# Altium schematic sheet Pipa PRM.SchDoc
size 1188 x 840 mm; SheetNumber: 1; SheetTotal: 1
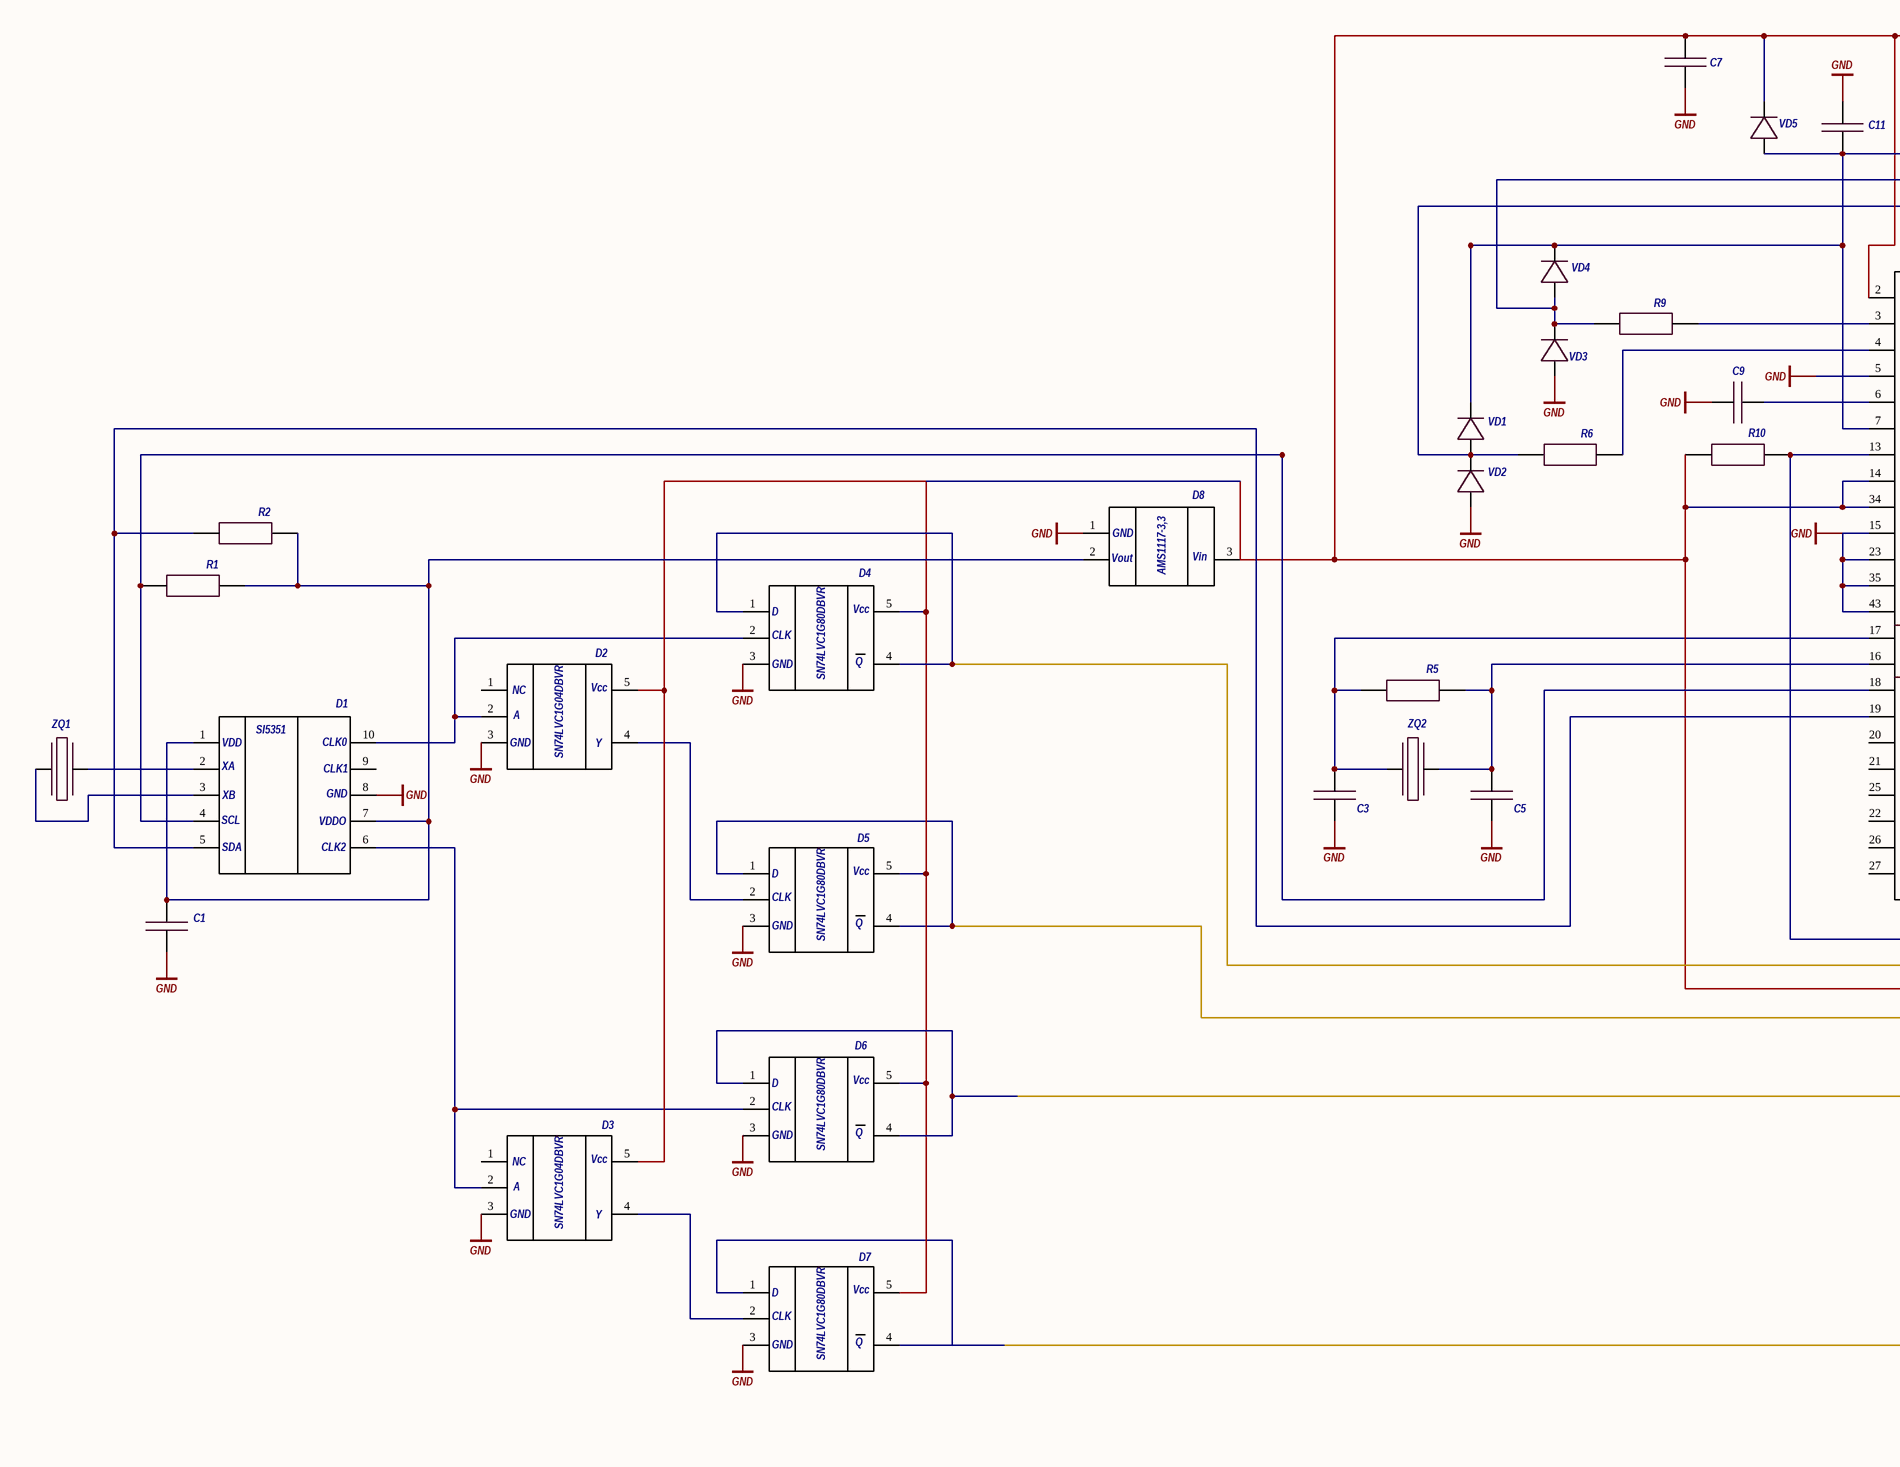
[diagram p0: Pipa PRM.SchDoc, top left]
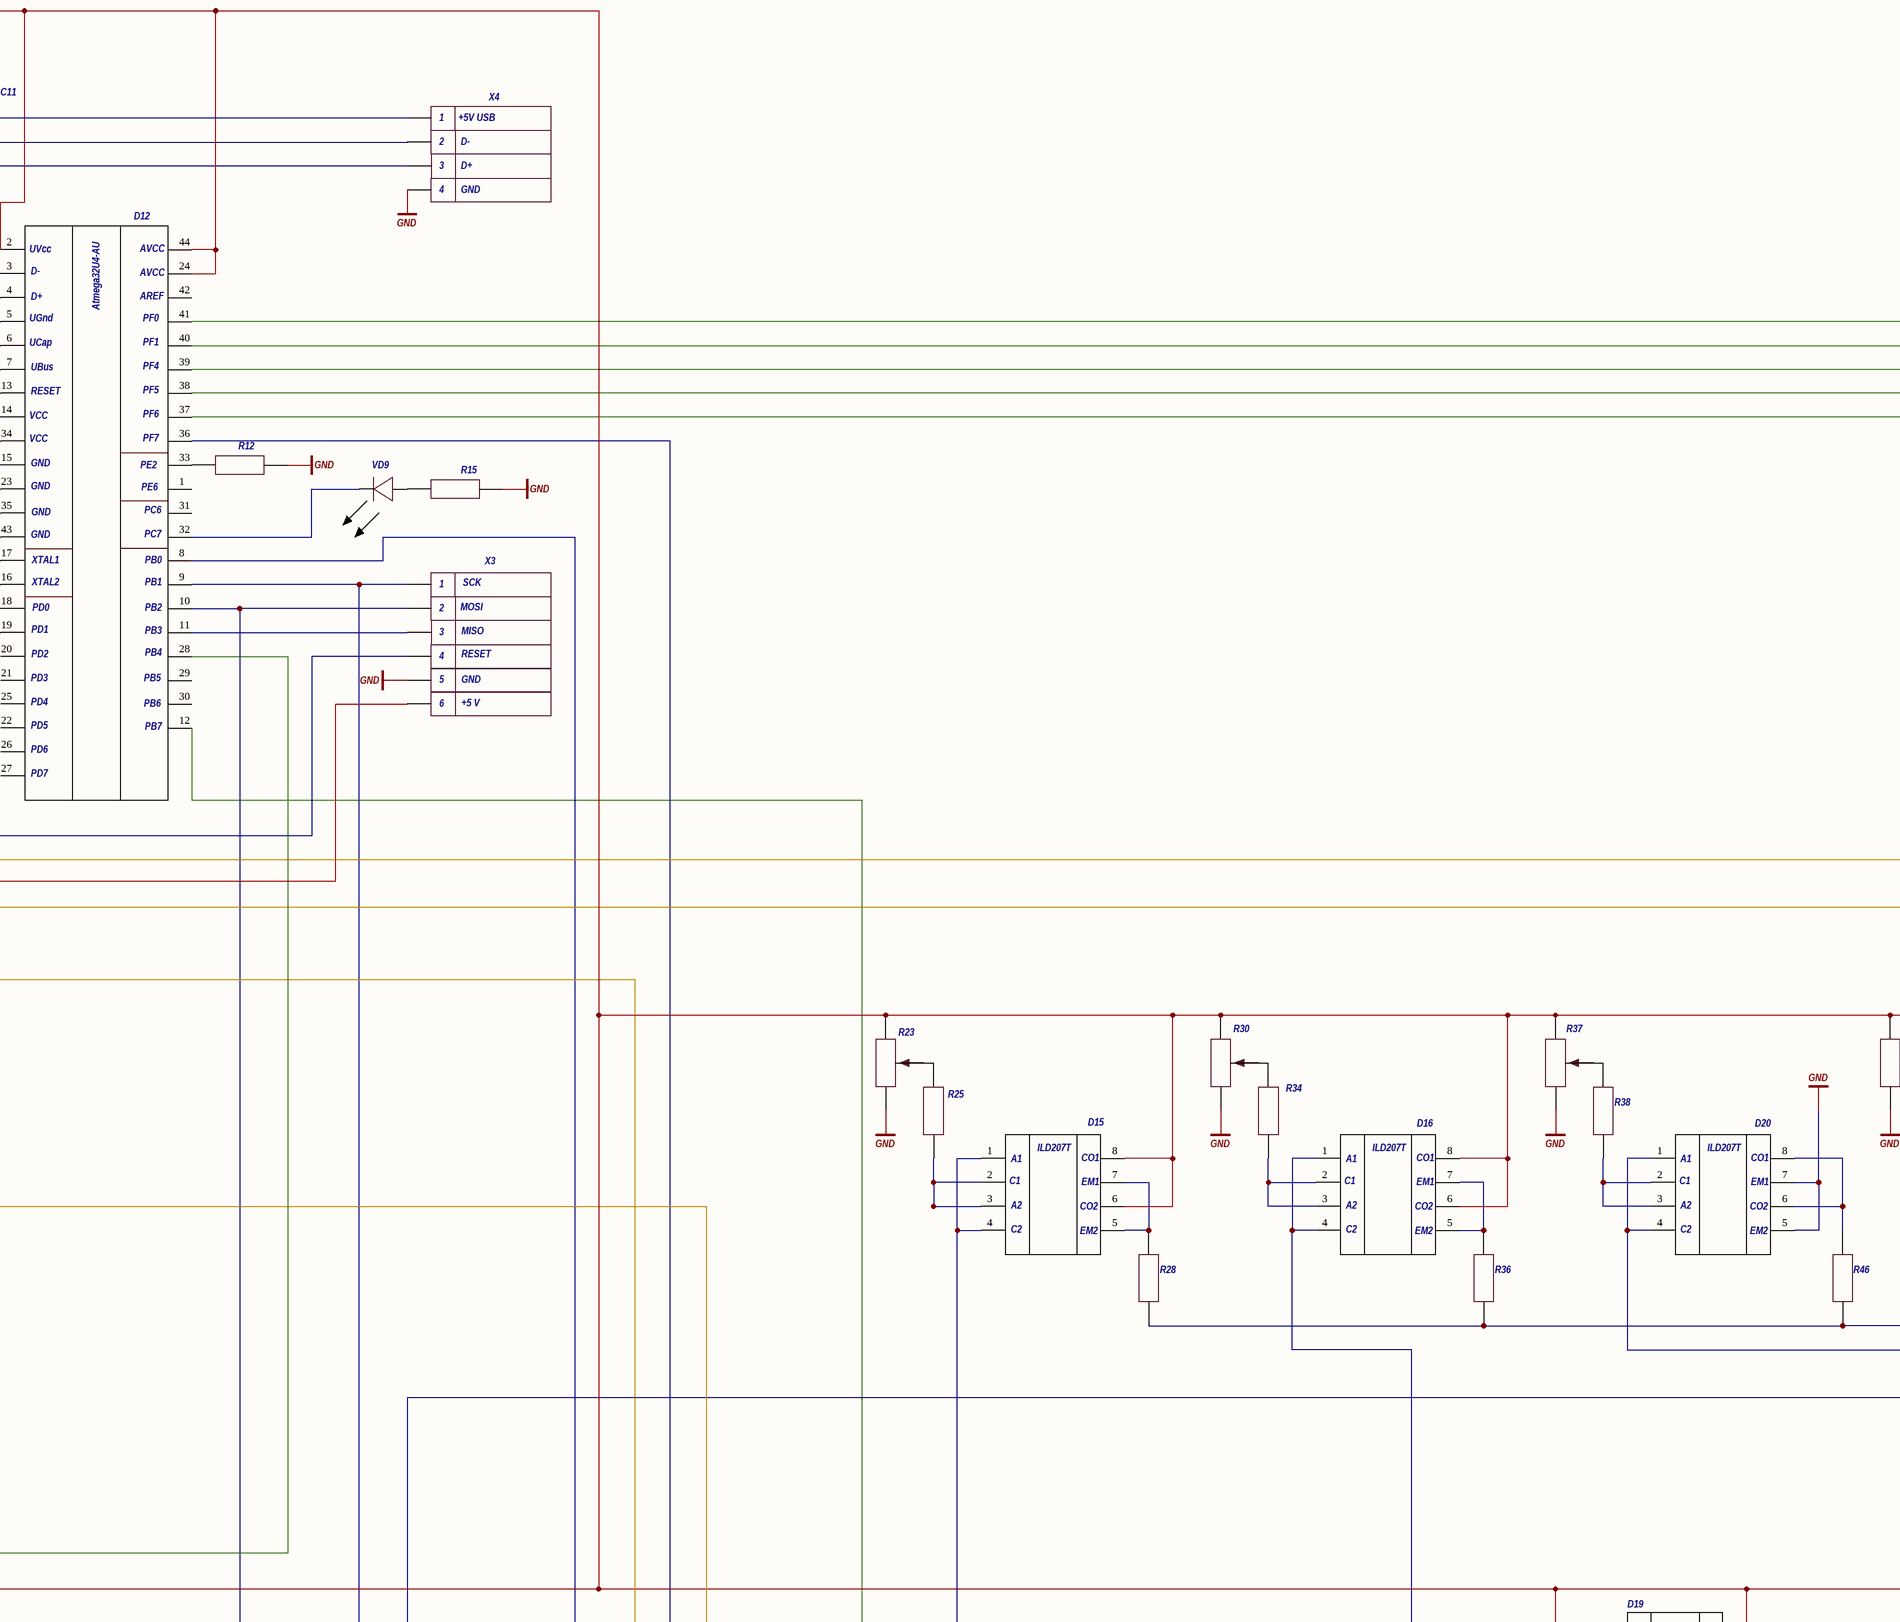
[diagram p1: Pipa PRM.SchDoc, top middle]
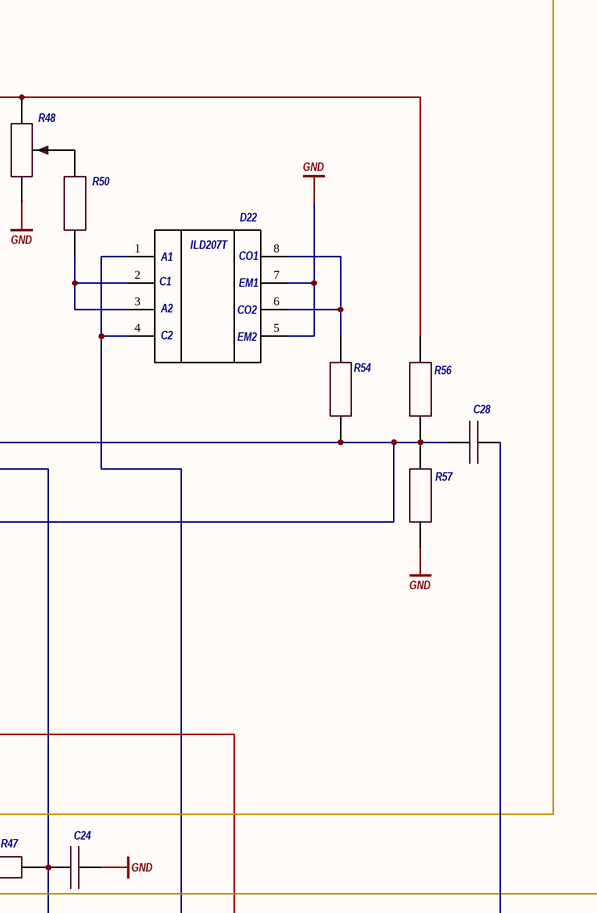
[diagram p2: Pipa PRM.SchDoc, top right]
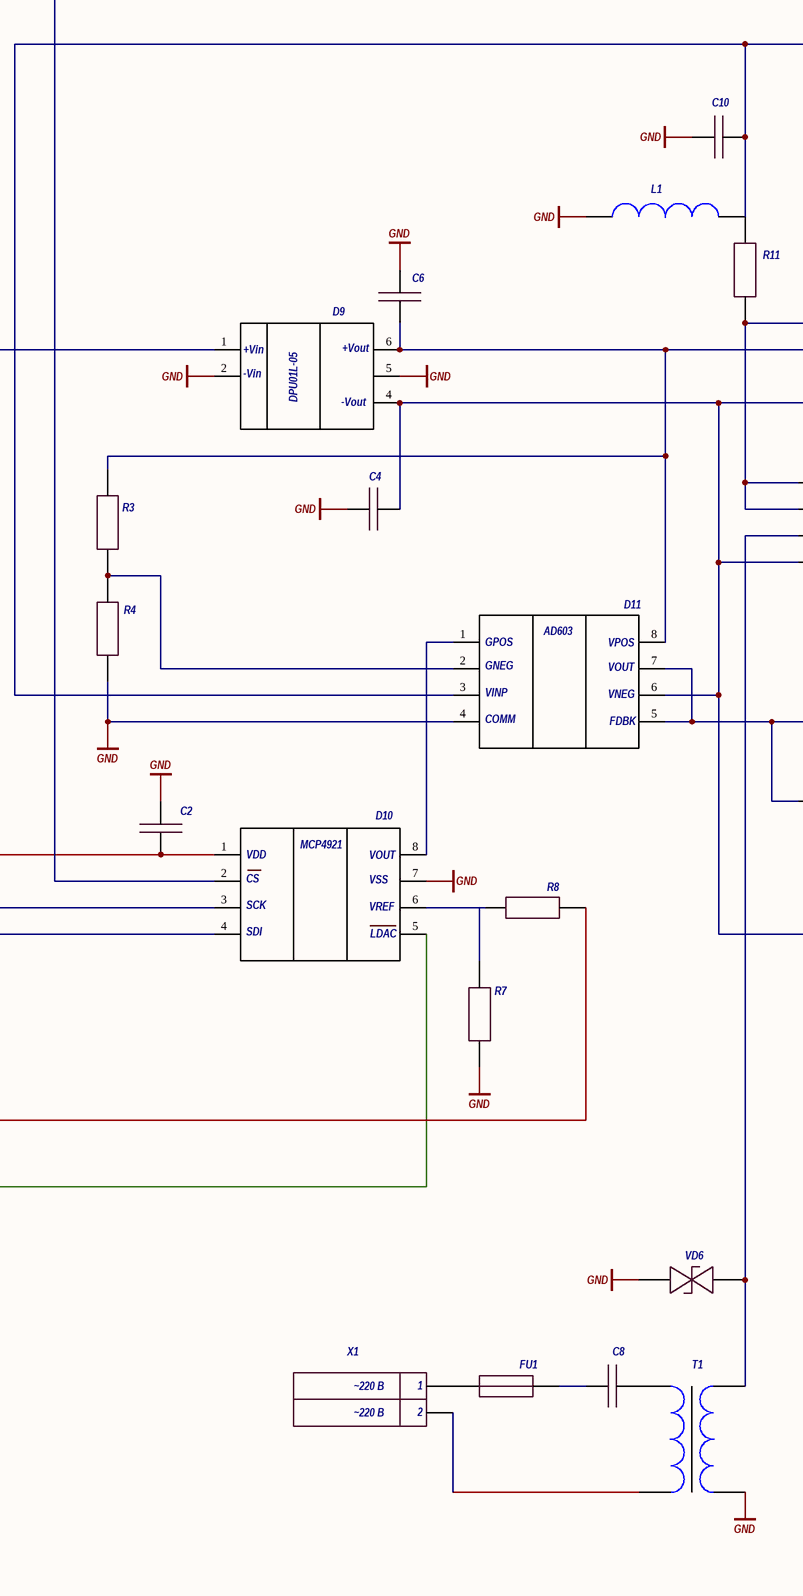
[diagram p3: Pipa PRM.SchDoc, bottom left]
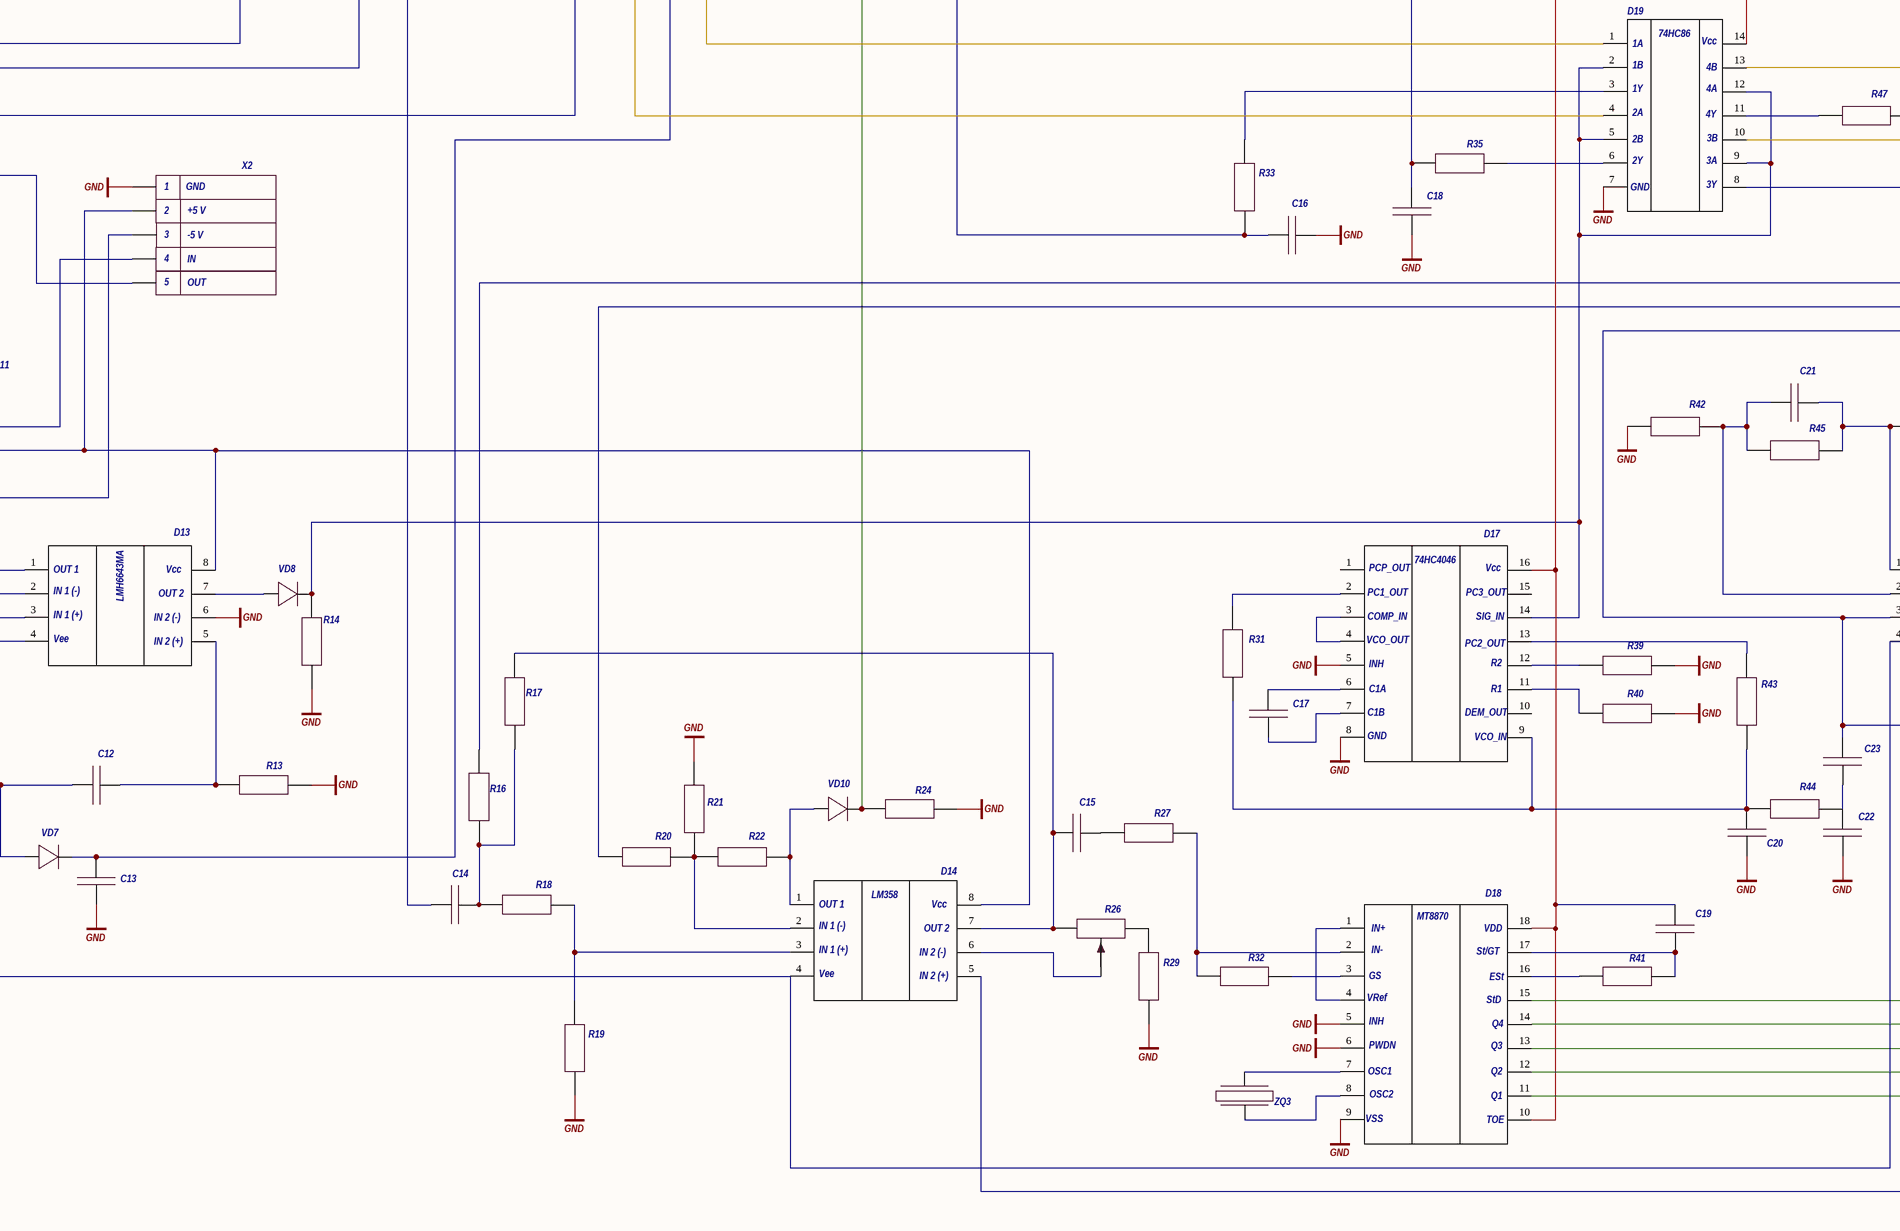
[diagram p4: Pipa PRM.SchDoc, bottom middle]
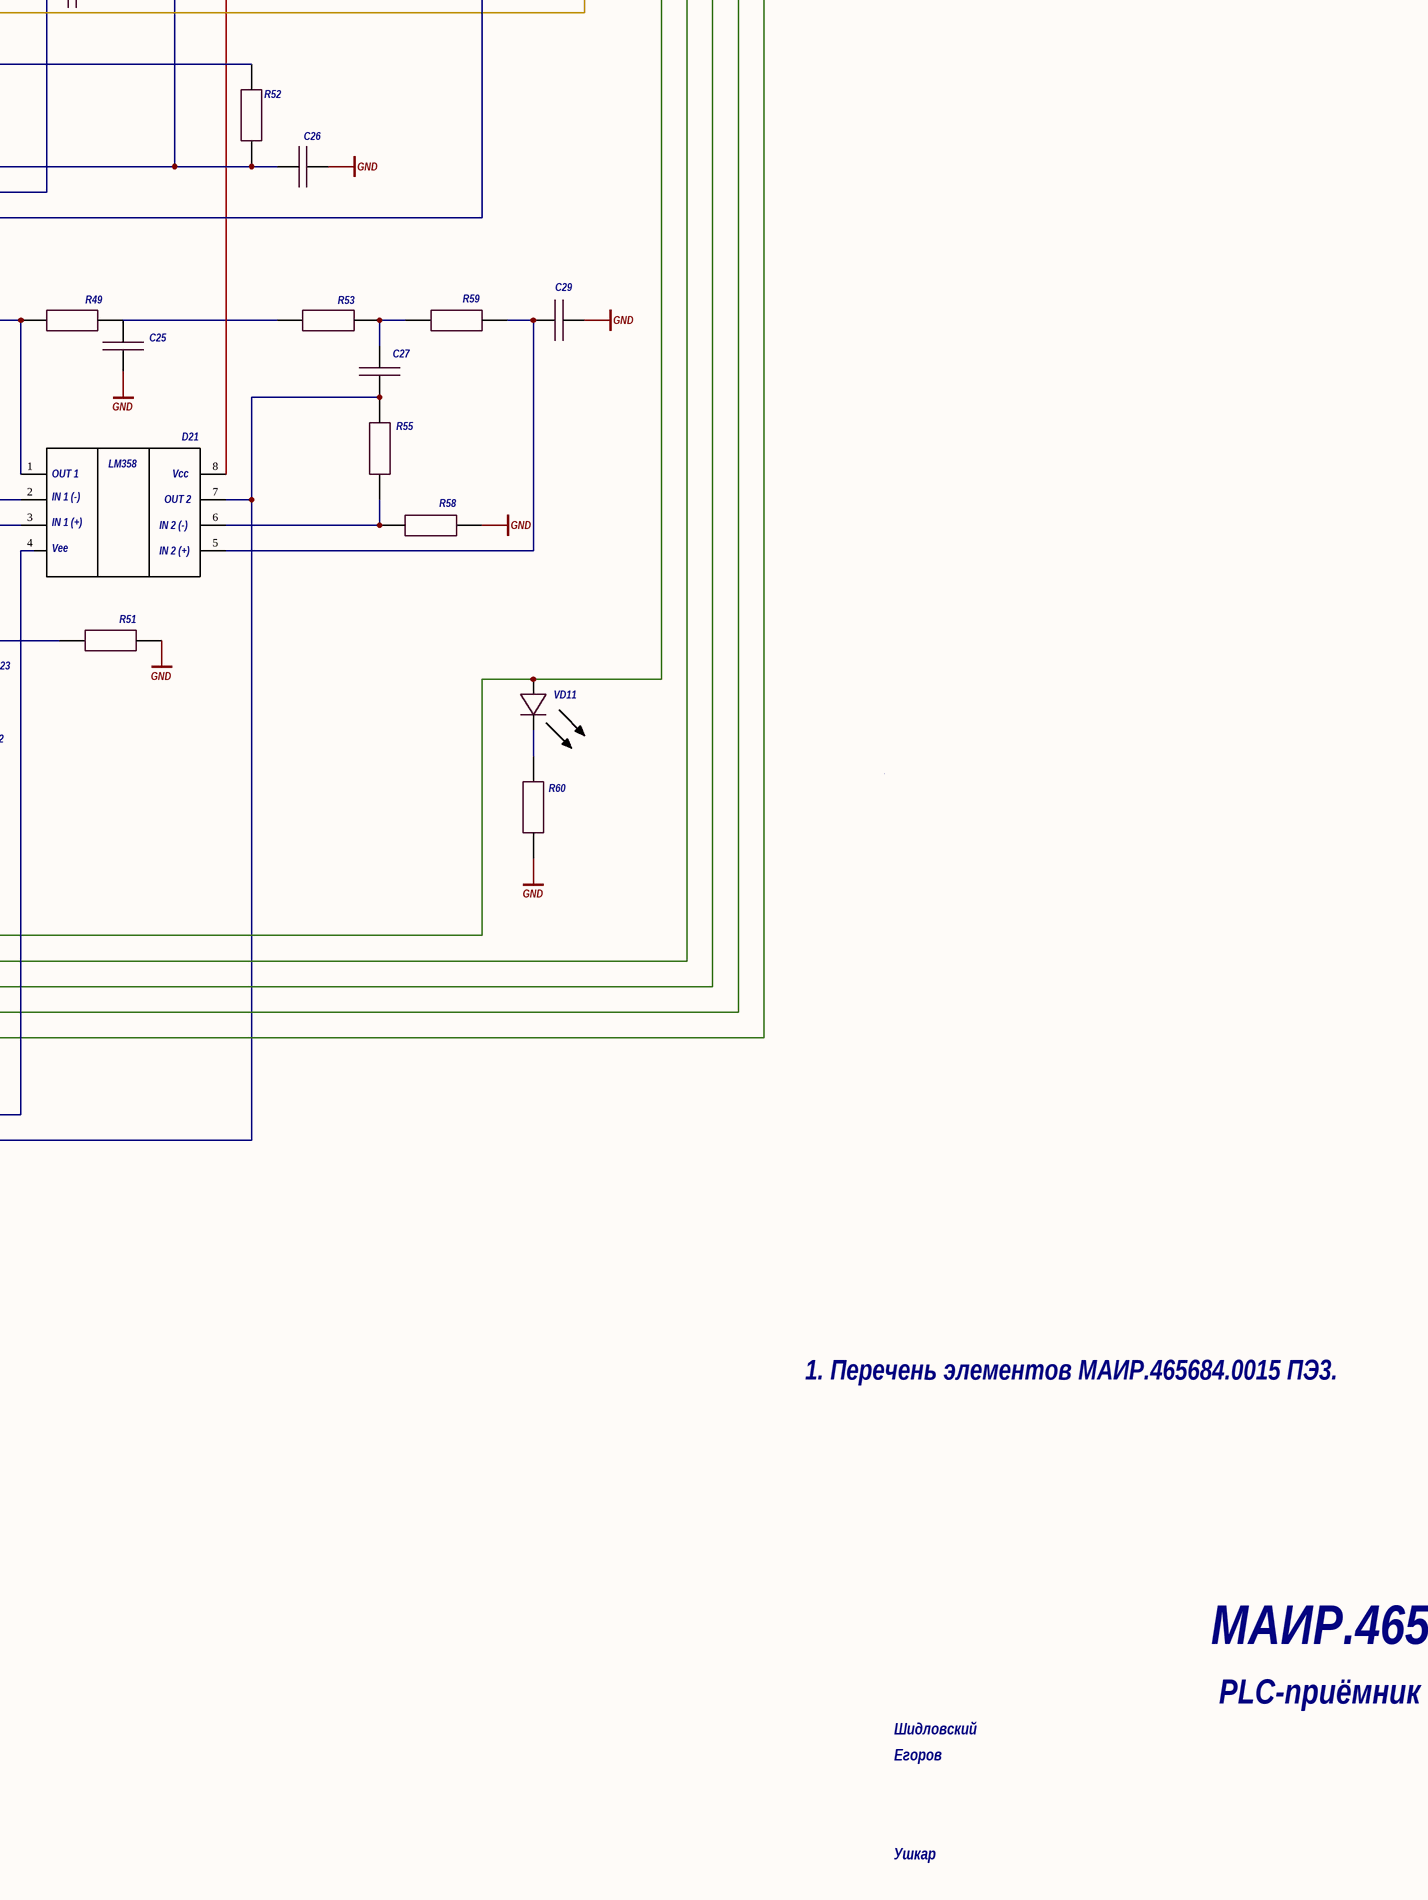
[diagram p5: Pipa PRM.SchDoc, bottom right]

## Parts
C1  22 мкФ  [С_0805]  (value not drawn)
C2  4,7 мкФ  (value not drawn)
C3  24 пФ  (value not drawn)
C4  22 мкФ  (value not drawn)
C5  24 пФ  (value not drawn)
C6  22 мкФ  (value not drawn)
C7  470 мкФ 6,3 В Электролит.  (value not drawn)
C8  Конденсатор  [С_0805]  (value not drawn)
C9  1 мкФ  (value not drawn)
C10  Конденсатор  (value not drawn)
C11  10 мкФ  (value not drawn)
C12  10 мкФ  (value not drawn)
C13  1 мкФ  (value not drawn)
C14  22 мкФ  (value not drawn)
C15  1 мкФ  [С_0805]  (value not drawn)
C16  100 мкФ (1206)  (value not drawn)
C17  Конденсатор  [С_0805]  (value not drawn)
C18  100 мкФ (1206)  (value not drawn)
C19  0,01 мкФ  [С_0805]  (value not drawn)
C20  Конденсатор  [C_1206]  (value not drawn)
C21  Конденсатор  [С_0805]  (value not drawn)
C22  Конденсатор  [С_0805]  (value not drawn)
C23  22 мкФ  (value not drawn)
C24  100 мкФ (1206)  (value not drawn)
C25  4,3 нФ  (value not drawn)
C26  100 мкФ (1206)  (value not drawn)
C27  11 нФ  (value not drawn)
C28  22 мкФ  (value not drawn)
C29  620 пФ  (value not drawn)
D1  Микросхема SI5351  [MSOP-10]  (value not drawn)
D2  Микросхема SN74LVC1G04DBVR  (value not drawn)
D3  Микросхема SN74LVC1G04DBVR  (value not drawn)
D4  Микросхема SN74LVC1G80DBVR  (value not drawn)
D5  Микросхема SN74LVC1G80DBVR  (value not drawn)
D6  Микросхема SN74LVC1G80DBVR  (value not drawn)
D7  Микросхема SN74LVC1G80DBVR  (value not drawn)
D8  Микросхема AMS1117-3,3  [SOT-223]  (value not drawn)
D9  Микросхема DPU01L-05  (value not drawn)
D10  Микросхема MCP4921  (value not drawn)
D11  Микросхема AD603  (value not drawn)
D12  Микросхема ATmega32U4-AU  (value not drawn)
D13  Микросхема LMH6643MA  (value not drawn)
D14  D  [SOP-8]  (value not drawn)
D15  Микросхема ILD207T  (value not drawn)
D16  Микросхема ILD207T  (value not drawn)
D17  D  [SO16]  (value not drawn)
D18  D  [DIP18]  (value not drawn)
D19  Микросхема 74HC86  (value not drawn)
D20  Микросхема ILD207T  (value not drawn)
D21  D  [SOP-8]  (value not drawn)
D22  Микросхема ILD207T  (value not drawn)
FU1  H520PT  [FU_522.1100]  (value not drawn)
L1  Катушка индуктивности  (value not drawn)
R1  10 кОм  [R_0805]  (value not drawn)
R2  10 кОм  [R_0805]  (value not drawn)
R3  18 кОм  (value not drawn)
R4  2 кОм  (value not drawn)
R5  1 МОм  (value not drawn)
R6  22 Ом  (value not drawn)
R7  1,2 кОм  (value not drawn)
R8  4,7 кОм  (value not drawn)
R9  22 Ом  (value not drawn)
R10  10 кОм  (value not drawn)
R11  Резистор  (value not drawn)
R12  10 кОм  (value not drawn)
R13  100 кОм  (value not drawn)
R14  10 кОм  (value not drawn)
R15  1 кОм  (value not drawn)
R16  1 МОм  (value not drawn)
R17  1 МОм  (value not drawn)
R18  0 Ом  (value not drawn)
R19  1 МОм  (value not drawn)
R20  1 МОм  (value not drawn)
R21  0 Ом  (value not drawn)
R22  1 МОм  (value not drawn)
R23  100 Ом 3362P-1-101LF  (value not drawn)
R24  10 кОм  (value not drawn)
R25  1 кОм  (value not drawn)
R26  10 кОм 3362P-1-103LF  (value not drawn)
R27  100 кОм  [R_0805]  (value not drawn)
R28  10 кОм  (value not drawn)
R29  1 кОМ  [R_0805]  (value not drawn)
R30  100 Ом 3362P-1-101LF  (value not drawn)
R31  Резистор  [R_0805]  (value not drawn)
R32  100 кОм  [R_0805]  (value not drawn)
R33  100 Ом  (value not drawn)
R34  1 кОм  (value not drawn)
R35  100 Ом  (value not drawn)
R36  10 кОм  (value not drawn)
R37  100 Ом 3362P-1-101LF  (value not drawn)
R38  1 кОм  (value not drawn)
R39  Резистор  [R_0805]  (value not drawn)
R40  Резистор  [R_0805]  (value not drawn)
R41  10 кОм  [R_0805]  (value not drawn)
R42  Резистор  [R_0805]  (value not drawn)
R43  Резистор  [R_0805]  (value not drawn)
R44  Резистор  [R_0805]  (value not drawn)
R45  Резистор  [R_0805]  (value not drawn)
R46  10 кОм  (value not drawn)
R47  100 Ом  (value not drawn)
R48  100 Ом 3362P-1-101LF  (value not drawn)
R49  10 кОм  (value not drawn)
R50  1 кОм  (value not drawn)
R51  100 кОм  (value not drawn)
R52  100 Ом  (value not drawn)
R53  10 кОм  (value not drawn)
R54  10кОм  (value not drawn)
R55  0 Ом  (value not drawn)
R56  10 кОм  (value not drawn)
R57  10 кОм  (value not drawn)
R58  1 МОм  (value not drawn)
R59  10 кОм  (value not drawn)
R60  1 кОм  [R_0805]  (value not drawn)
T1  PLA10AS3021  [T_PLA10]  (value not drawn)
VD1  BAT60AE (SOD-323)  (value not drawn)
VD2  BAT60AE (SOD-323)  (value not drawn)
VD3  BAT60AE (SOD-323)  (value not drawn)
VD4  BAT60AE (SOD-323)  (value not drawn)
VD5  SS14 (DO-214AC)  (value not drawn)
VD6  PESD5V0 (SOD-323)  (value not drawn)
VD7  BAT60AE (SOD-323)  (value not drawn)
VD8  BAT60AE (SOD-323)  (value not drawn)
VD9  Красный (0805)  (value not drawn)
VD10  BAT60AE (SOD-323)  (value not drawn)
VD11  Белый (0805)  [VD_0603 SMD LED]  (value not drawn)
X1  Разъём 2 пин  [X_GT950-9.5-02P-14-00]  (value not drawn)
X2  PBS-5  (value not drawn)
X3  PLS-6  (value not drawn)
X4  USB-B  (value not drawn)
ZQ1  25 МГц в отв.  [ZQ_SJK-6C-25.000-16- 50-30-F-C-50-HJ]  (value not drawn)
ZQ2  16 МГц в отв.  (value not drawn)
ZQ3  3,579545 МГц в отв.  [HC-49U]  (value not drawn)

## Nets
GND: C1.2 C2.2 C3.1 C4.1 C5.1 C6.2 C7.1 C9.2 C10.1 C11.2 C13.1 C16.1 C18.1 C20.2 C22.2 C24.1 C25.1 C26.1 C29.2 D1.8 D2.3 D3.3 D4.3 D5.3 D6.3 D7.3 D8.1 D9.2 D9.5 D10.7 D11.4 D12.5 D12.15 D12.23 D12.35 D12.43 D13.6 D17.5 D17.8 D18.5 D18.6 D18.9 D19.7 D20.5 D20.7 D22.5 D22.7 L1.1 R4.1 R7.1 R12.2 R13.2 R14.2 R15.2 R19.1 R21.2 R23.2 R24.2 R29.2 R30.2 R37.2 R39.2 R40.2 R42.2 R48.2 R51.2 R57.2 R58.1 R60.2 T1.3 VD2.1 VD3.1 VD6.1 X2.1 X3.5 X4.4
NetC1_1: C1.1 D1.1 D1.7 D8.2 R1.1 R2.1
NetC2_1: C2.1 C7.2 C19.2 D2.5 D3.5 D4.5 D5.5 D6.5 D7.5 D8.3 D9.1 D10.1 D12.2 D12.14 D12.24 D12.34 D12.44 D15.6 D15.8 D16.6 D16.8 D17.16 D18.10 D18.18 D19.14 D21.8 R8.2 R10.2 R23.1 R30.1 R37.1 R48.1 R56.1 VD5.2 X3.6
NetC3_2: C3.2 D12.17 R5.1 ZQ2.1
NetC4_2: C4.2 D9.4 D11.6 D13.4 D14.4 D21.4 X2.3
NetC5_2: C5.2 D12.16 R5.2 ZQ2.2
NetC6_1: C6.1 D9.6 D11.8 D13.8 D14.8 R3.2 X2.2
NetC8_1: C8.1 FU1.2
NetC8_2: C8.2 T1.1
NetC9_1: C9.1 D12.6
NetC10_2: C10.2 D11.3 L1.2 R11.1 X2.5
NetC11_1: C11.1 D12.7 VD1.2 VD4.2 VD5.1 X4.1
NetC12_1: C12.1 D11.5 D11.7 VD7.1
NetC12_2: C12.2 D13.5 R13.1
NetC13_2: C13.2 D12.36 VD7.2
NetC14_1: C14.1 R16.1 R17.1 R18.1
NetC14_2: C14.2 C28.2 R28.1 R36.1 R46.2 R54.2 R56.2 R57.1
NetC15_1: C15.1 R27.2
NetC15_2: C15.2 D14.7 R17.2 R26.2
NetC16_2: C16.2 D15.1 D15.4 R33.1
NetC17_1: C17.1 D17.7
NetC17_2: C17.2 D17.6
NetC18_2: C18.2 D16.1 D16.4 R35.1
NetC19_1: C19.1 D18.17 R41.2
NetC20_1: C20.1 D17.9 R31.2 R43.1 R44.1
NetC21_1: C21.1 D21.1 R45.1 R49.1
NetC21_2: C21.2 D21.2 R42.1 R45.2
NetC22_1: C22.1 C23.1 R44.2
NetC23_2: C23.2 C28.1 D21.3 R51.1
NetC24_2: C24.2 D20.1 D20.4 R20.1 R47.2
NetC25_2: C25.2 R49.2 R53.1
NetC26_2: C26.2 D22.1 D22.4 R16.2 R52.1
NetC27_1: C27.1 D14.5 D21.7 R55.2
NetC27_2: C27.2 R53.2 R59.1
NetC29_1: C29.1 D21.5 R59.2
NetD1_2: D1.2 ZQ1.2
NetD1_3: D1.3 ZQ1.1
NetD1_4: D1.4 D12.18 R1.2
NetD1_5: D1.5 D12.19 R2.2
NetD1_6: D1.6 D3.2 D6.2
NetD1_10: D1.10 D2.2 D4.2
NetD2_4: D2.4 D5.2
NetD3_4: D3.4 D7.2
NetD4_1: D4.1 D4.4 D19.13
NetD5_1: D5.1 D5.4 D19.10
NetD6_1: D6.1 D6.4 D19.4
NetD7_1: D7.1 D7.4 D19.1
NetD10_2: D10.2 D12.8
NetD10_3: D10.3 D12.9 X3.1
NetD10_4: D10.4 D12.10 X3.2
NetD10_5: D10.5 D12.28
NetD10_6: D10.6 R7.2 R8.1
NetD10_8: D10.8 D11.1
NetD11_2: D11.2 R3.1 R4.2
NetD12_3: D12.3 R9.2
NetD12_4: D12.4 R6.2
NetD12_11: D12.11 X3.3
NetD12_12: D12.12 R24.1 VD10.2
NetD12_13: D12.13 R10.1 X3.4
NetD12_32: D12.32 VD9.2
NetD12_33: D12.33 R12.1
NetD12_37: D12.37 D18.11
NetD12_38: D12.38 D18.12
NetD12_39: D12.39 D18.13
NetD12_40: D12.40 D18.14
NetD12_41: D12.41 D18.15 VD11.1
NetD13_1: D13.1 D13.2 R11.2 X2.4
NetD13_3: D13.3 T1.4 VD6.2
NetD13_7: D13.7 VD8.1
NetD14_1: D14.1 R22.1 VD10.1
NetD14_2: D14.2 R20.2 R21.1 R22.2
NetD14_3: D14.3 R18.2 R19.2
NetD14_6: D14.6 R26.3
NetD15_2: D15.2 D15.3 R25.2
NetD15_5: D15.5 D15.7 R28.2
NetD16_2: D16.2 D16.3 R34.2
NetD16_5: D16.5 D16.7 R36.2
NetD17_2: D17.2 R31.1
NetD17_3: D17.3 D17.4
NetD17_11: D17.11 R40.1
NetD17_12: D17.12 R39.1
NetD17_13: D17.13 R43.2
NetD17_14: D17.14 D19.2 D19.5 D19.9 D19.12 R14.1 VD8.2
NetD18_1: D18.1 D18.4
NetD18_2: D18.2 R27.1 R32.1
NetD18_3: D18.3 R32.2
NetD18_7: D18.7 ZQ3.1
NetD18_8: D18.8 ZQ3.2
NetD18_16: D18.16 R41.1
NetD19_3: D19.3 R33.2
NetD19_6: D19.6 R35.2
NetD19_8: D19.8 R52.2
NetD19_11: D19.11 R47.1
NetD20_2: D20.2 D20.3 R38.2
NetD20_6: D20.6 D20.8 R46.1
NetD21_6: D21.6 R55.1 R58.2
NetD22_2: D22.2 D22.3 R50.2
NetD22_6: D22.6 D22.8 R54.1
NetFU1_1: FU1.1 X1.1
NetR6_1: R6.1 VD1.1 VD2.2 X4.3
NetR9_1: R9.1 VD3.2 VD4.1 X4.2
NetR15_1: R15.1 VD9.1
NetR23_3: R23.3 R25.1
NetR26_1: R26.1 R29.1
NetR30_3: R30.3 R34.1
NetR37_3: R37.3 R38.1
NetR48_3: R48.3 R50.1
NetR60_1: R60.1 VD11.2
NetT1_2: T1.2 X1.2

Not connected (* = marked no-connect by the designer): D1 9; D2 1; D3 1; D12 1 20 21 22 25 26 27 29 30 31 42; D17 1 10 15

## Notes on the sheet
- (near X4) +5V USB
- (near X4) D-
- (near X4) D+
- (near X4) GND
- (near X3) SCK
- (near X3) MOSI
- (near X3) MISO
- (near X3) RESET
- (near X3) GND
- (near X3) +5 V
- (near X2) GND
- (near X2) +5 V
- (near X2) -5 V
- (near X2) IN
- (near X2) OUT
- (near X1) ~220 В
- 1. Перечень элементов МАИР.465684.0015 ПЭ3.
- МАИР.465684.0015 Э3
- PLC-приёмник
- Шидловский
- Егоров
- Ушкар
- Подп. и дата
- Инв. № дубл.
- Взам. инв. №
- Изм.
- Лист
- № докум.
- Подп.
- Дата
- Лит.
- Масса
- Масштаб
- Т.контр.
- Пров.
- Разраб.
- Схема электрическая
- принципиальная
- Листов
- 1
- Инв. № подл.
- Н.контр.
- Утв.
- Копировал
- Формат А0
- (in symbol Микросхема 74HC86) 74НС86; 1A; Vcc; 1B; 4B; 1Y; 4A; 2A; 4Y; 2B; 3B; 2Y; 3A; 3Y; GND
- (in symbol Микросхема 74НС4046) 74НС4046; PCP_OUT; Vcc; PC1_OUT; PC3_OUT; COMP_IN; SIG_IN; VCO_OUT; PC2_OUT; INH; R2; C1A; R1; C1B; DEM_OUT; GND; VCO_IN
- (in symbol Микросхема AD603) AD603; GPOS; VPOS; GNEG; VOUT; VINP; VNEG; COMM; FDBK
- (in symbol Микросхема AMS1117-3,3) GND; Vout; Vin; AMS1117-3,3
- (in symbol Микросхема ATmega32U4-AU) UVcc; AVCC; D-; D+; AREF; Atmega32U4-AU; UGnd; PF0; UCap; PF1; UBus; PF4; RESET; PF5; VCC; PF6; PF7; GND; PE2; PE6; PC6; PC7; XTAL1; PB0; XTAL2; PB1; PD0; PB2; PD1; PB3; PD2; PB4; PD3; PB5; PD4; PB6; PD5; PB7; PD6; PD7
- (in symbol Микросхема DPU01L-05) +Vin; +Vout; -Vin; DPU01L-05; -Vout
- (in symbol Микросхема ILD207T) ILD207T; A1; CO1; C1; EM1; A2; CO2; C2; EM2
- (in symbol Микросхема LM358) LM358; OUT 1; Vcc; IN 1 (-); OUT 2; IN 1 (+); IN 2 (-); Vee; IN 2 (+)
- (in symbol Микросхема LMH6643MA) OUT 1; Vcc; IN 1 (-); LMH6643MA; OUT 2; IN 1 (+); IN 2 (-); Vee; IN 2 (+)
- (in symbol Микросхема MCP4921) MCP4921; VDD; VOUT; CS; VSS; SCK; VREF; SDI; LDAC
- (in symbol Микросхема MT8870) MT8870; IN+; VDD; IN-; St/GT; GS; ESt; VRef; StD; INH; Q4; PWDN; Q3; OSC1; Q2; OSC2; Q1; VSS; TOE
- (in symbol Микросхема SI5351) SI5351; VDD; CLK0; XA; CLK1; GND; XB; SCL; VDDO; SDA; CLK2
- (in symbol Микросхема SN74LVC1G04DBVR) Vcc; NC; A; GND; Y; SN74LVC1G04DBVR
- (in symbol Микросхема SN74LVC1G80DBVR) D; Vcc; CLK; Q; GND; SN74LVC1G80DBVR

## Library data of the parts
C1-C7 C9 C11-C16 C18 C19 C23-C29 = Конденсатор
D14 D21 = Микросхема LM358
D15 D16 D20 D22 = Микросхема ILD207T: Оптопара двойная
D17 = Микросхема 74НС4046
D18 = Микросхема MT8870
FU1 = Предохранитель
R1-R10 R12-R22 R24 R25 R27-R29 R32-R36 R38 R41 R46 R47 R49-R60 = Резистор
R23 R26 R30 R37 R48 = Потенциометр: Value: 100 k
T1 = Трансформатор 4 вывода
VD1-VD5 VD7 VD8 VD10 = Диод
VD6 = Варистор двойной
VD9 VD11 = Светодиод
X2 = Разъём 5 пин
X3 = Разъём 6 пин
X4 = Разъём 4 пин
ZQ1-ZQ3 = Резонатор